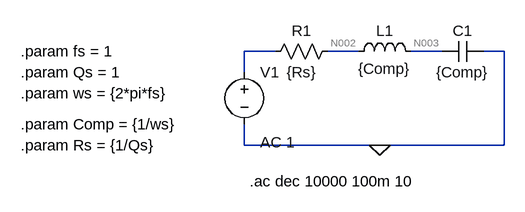
[diagram p0: schematic RLC - Serie.asc]
RLC - Serie.asc, the LTspice schematic file:
Version 4
SHEET 1 880 680
WIRE 112 80 64 80
WIRE 240 80 192 80
WIRE 368 80 320 80
WIRE 464 80 432 80
WIRE 64 112 64 80
WIRE 64 224 64 192
WIRE 272 224 64 224
WIRE 464 224 464 80
WIRE 464 224 272 224
FLAG 272 224 0
SYMBOL voltage 64 96 R0
WINDOW 123 24 124 Left 2
WINDOW 39 0 0 Left 0
SYMATTR InstName V1
SYMATTR Value ""
SYMATTR Value2 AC 1
SYMBOL res 208 64 R90
WINDOW 0 0 56 VBottom 2
WINDOW 3 32 56 VTop 2
SYMATTR InstName R1
SYMATTR Value {Rs}
SYMBOL ind 224 96 R270
WINDOW 0 32 56 VTop 2
WINDOW 3 5 56 VBottom 2
SYMATTR InstName L1
SYMATTR Value {Comp}
SYMBOL cap 432 64 R90
WINDOW 0 0 32 VBottom 2
WINDOW 3 32 32 VTop 2
SYMATTR InstName C1
SYMATTR Value {Comp}
TEXT -280 80 Left 2 !.param fs = 1
TEXT -280 112 Left 2 !.param Qs = 1
TEXT -280 192 Left 2 !.param Comp = {1/ws}
TEXT -280 224 Left 2 !.param Rs = {1/Qs}
TEXT 72 280 Left 2 !.ac dec 10000 100m 10
TEXT -280 144 Left 2 !.param ws = {2*pi*fs}

The netlist it stands for:
* RLC - Serie.asc
V1 N001 0 AC 1
R1 N002 N001 {Rs}
L1 N002 N003 {Comp}
C1 0 N003 {Comp}
.param fs = 1
.param Qs = 1
.param Comp = {1/ws}
.param Rs = {1/Qs}
.ac dec 10000 100m 10
.param ws = {2*pi*fs}
.backanno
.end

* Results of the author's LTspice run, read from the files saved beside the schematic
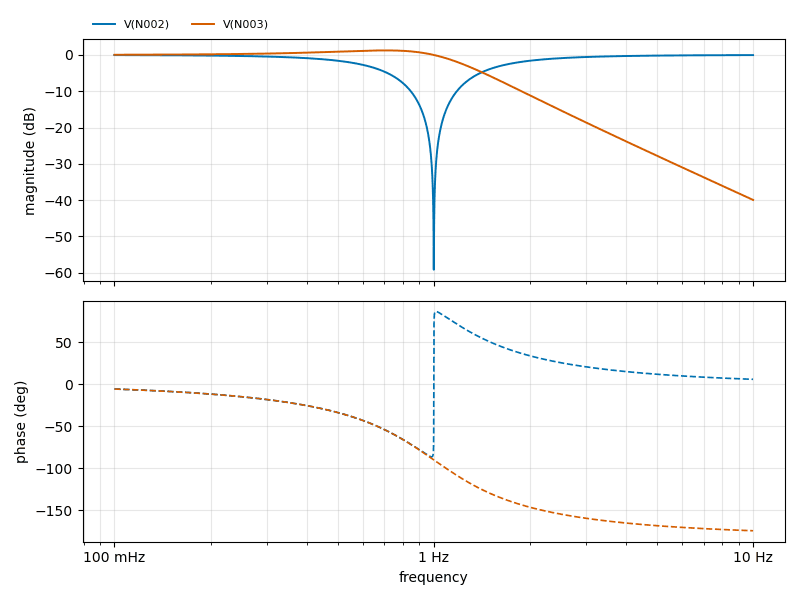
[diagram p1: AC Analysis of RLC - Serie.asc, plotted from the saved traces]
* AC Analysis, 1 run:
*   V(N002): -0.04 dB at 100 mHz, -0.04 dB at 10 Hz, peak -0.04 dB at 100 mHz, 3 dB below the peak at 620.6 mHz
*   V(N003): 0.04 dB at 100 mHz, -39.96 dB at 10 Hz, peak 1.24 dB at 706.5 mHz, 3 dB below the peak at 1.169 Hz